# Altium project AmperMeter.PrjPcb
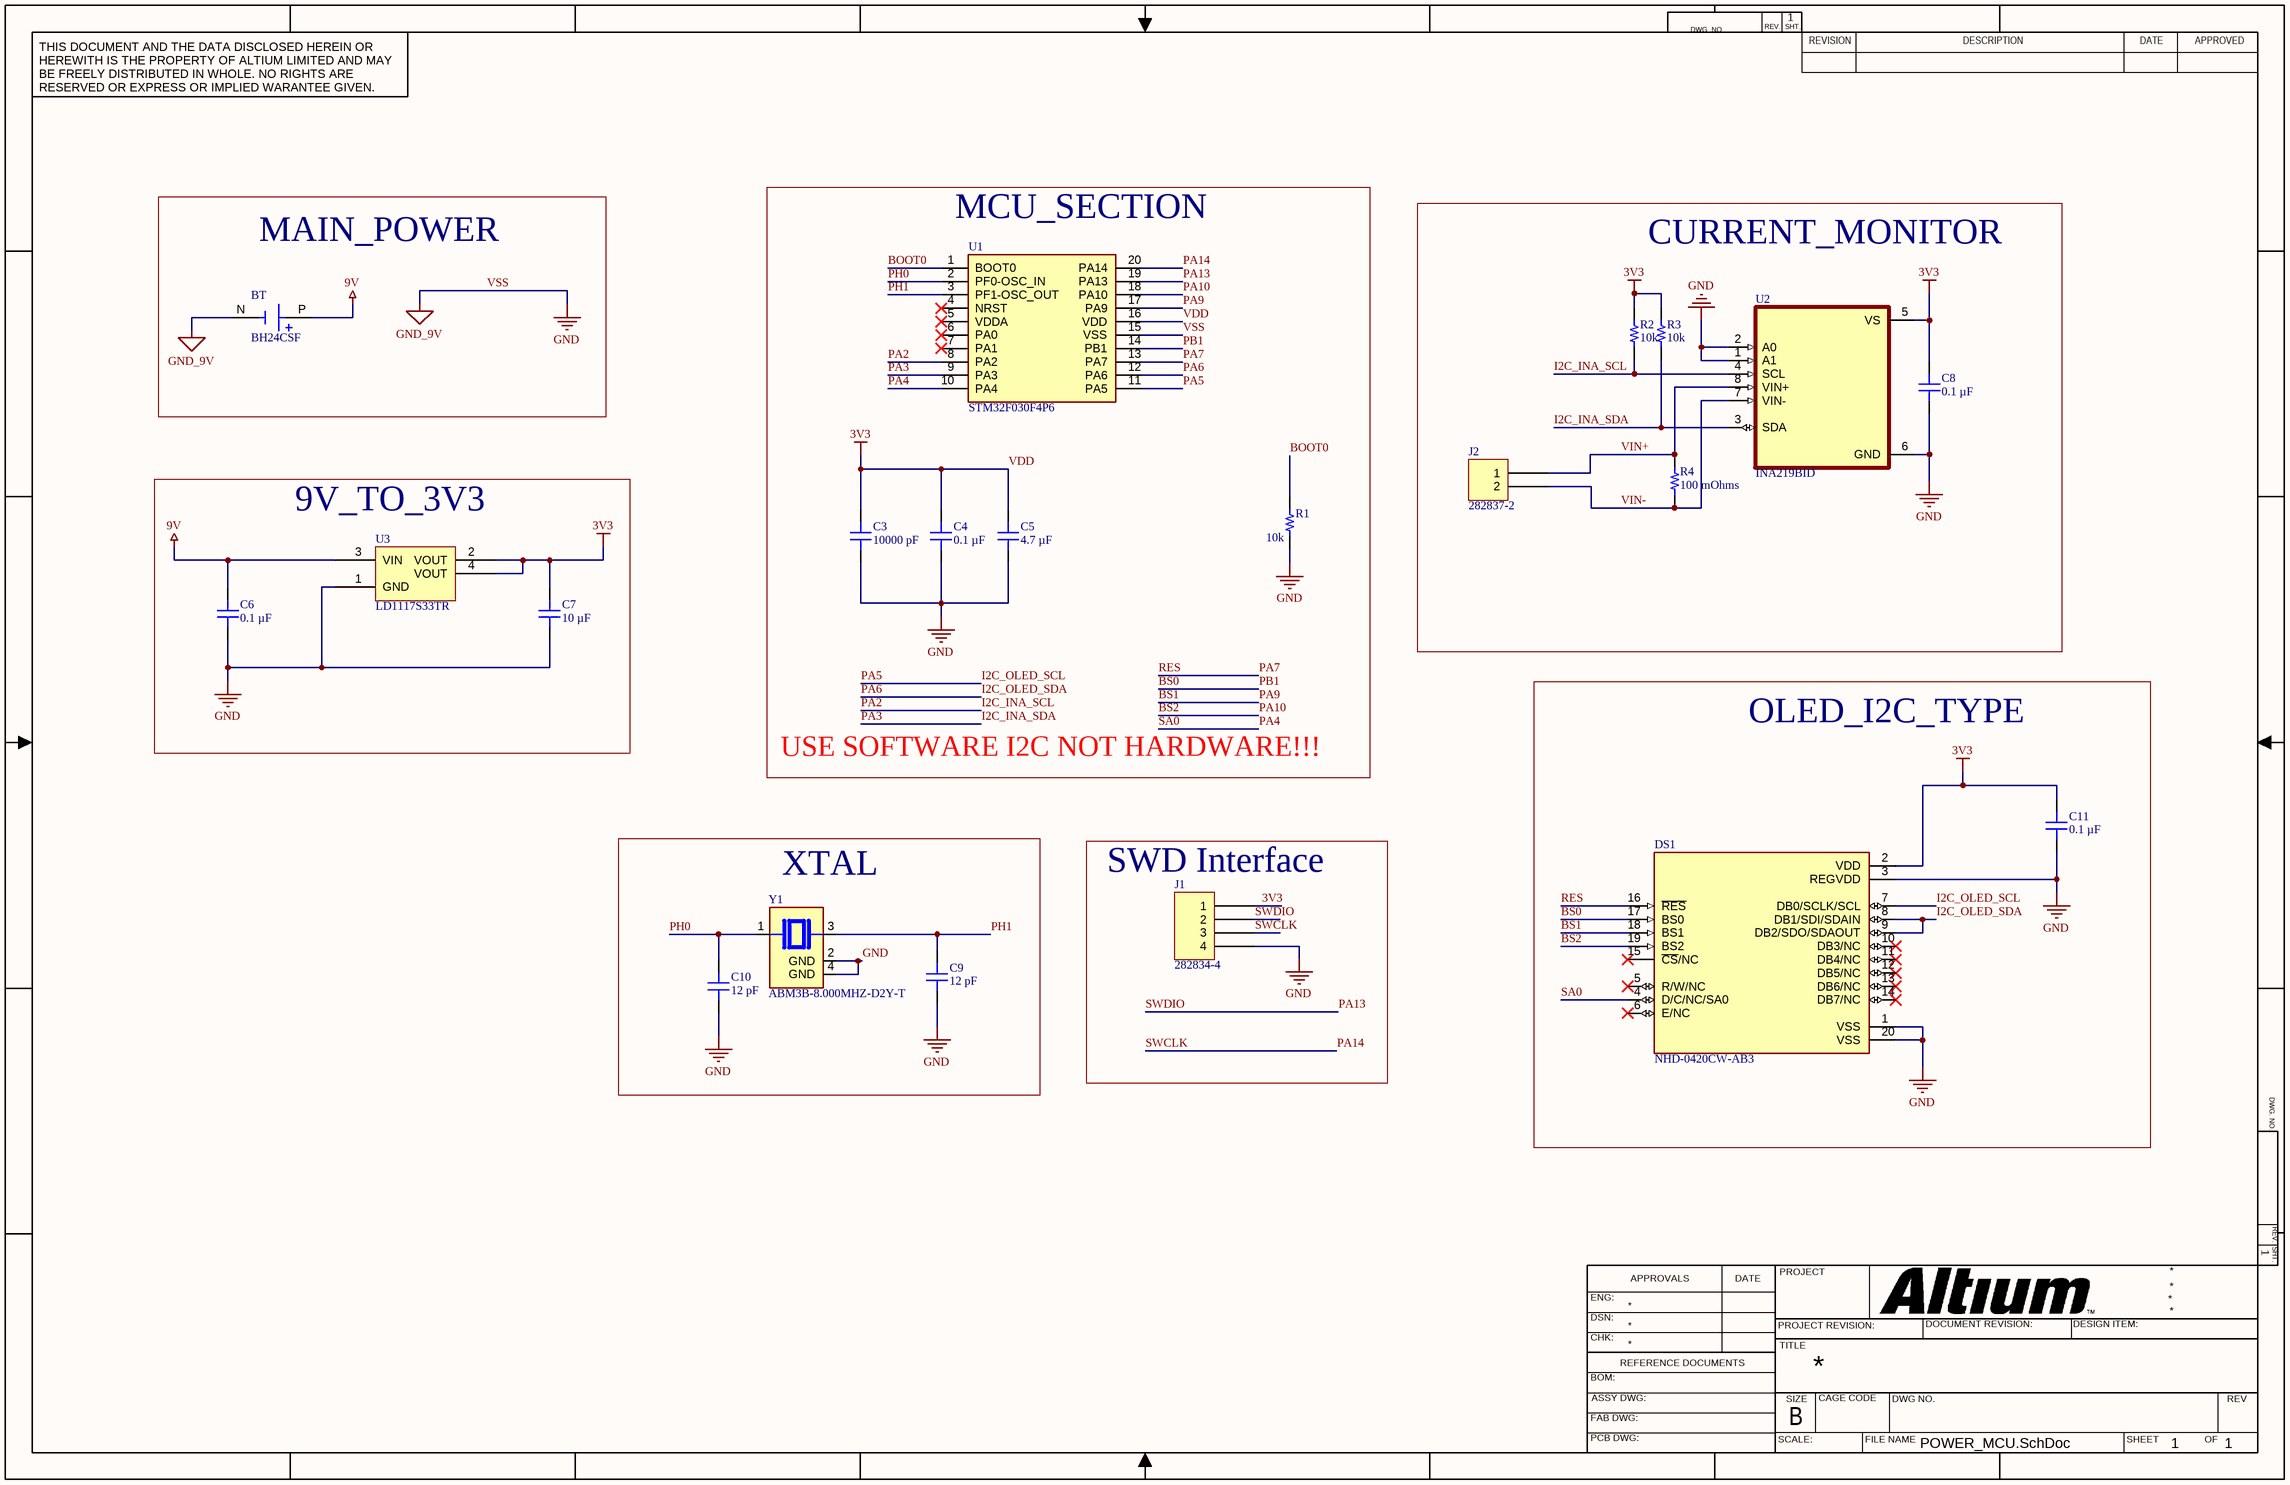
[diagram p0: POWER_MCU.SchDoc]
1 sheet, 21 parts. Net scope: global (net labels, ports and power ports of the same name join across sheets).
Board file: PCB2.PcbDoc

## Sheet POWER_MCU.SchDoc
size 431 x 279 mm; SheetNumber: 1; SheetTotal: 1

### Parts
BT  BH24CSF  [BAT_BH24CSF]
C3  10000 pF  [CAP 0805_2012]
C4  0.1 µF  [CAP 0805_2012]
C5  4.7 µF  [CAP 0805_2012]
C6  0.1 µF  [CAP 0805_2012]
C7  10 µF  [CAP 0805_2012]
C8  0.1 µF  [CAP 0805_2012]
C9  12 pF  [CAP 0402_1005]
C10  12 pF  [CAP 0402_1005]
C11  0.1 µF  [CAP 0805_2012]
DS1  NHD-0420CW-AB3  [LCD_NHD-0420CW-AB3]
J1  282834-4  [TE 282834-4]
J2  282837-2  [TE 282837-2]
R1  10k Ohms  [RES 0805_2012]  (value not drawn)
R2  10k  [RES 0805_2012]
R3  10k  [RES 0805_2012]
R4  100 mOhms  [RES 2512_6432]
U1  STM32F030F4P6  [TSSOP-20]
U2  INA219BID  [SOIC-8]
U3  LD1117S33TR  [ST SOT-223]
Y1  ABM3B-8.000MHZ-D2Y-T  [XTAL_ABM3B-8.000MHZ-D2Y-T]

### Blocks framed on the sheet
MAIN_POWER: BT
MCU_SECTION: C3-C5 R1 U1
CURRENT_MONITOR: C8 J2 R2-R4 U2
9V_TO_3V3: C6 C7 U3
OLED_I2C_TYPE: C11 DS1
XTAL: C9 C10 Y1
SWD Interface: J1

### Nets
3V3: C3.2 C4.2 C5.2 C7.2 C8.2 C11.2 DS1.2(VDD) J1.1 R2.2 R3.2 U1.16(VDD) U2.5(VS) U3.2(VOUT) U3.4(VOUT)  [also labelled VDD]
9V: BT.P(POS) C6.2 U3.3(VIN)
GND: BT.N(NEG) C3.1 C4.1 C5.1 C6.1 C7.1 C8.1 C9.1 C10.1 C11.1 DS1.1(VSS) DS1.3(REGVDD) DS1.20(VSS) J1.4 R1.1 U1.15(VSS) U2.1(A1) U2.2(A0) U2.6(GND) U3.1(GND) Y1.2(GND) Y1.4(GND)  [also labelled GND_9V, VSS]
BOOT0: R1.2 U1.1(BOOT0)
BS0: DS1.17(BS0) U1.14(PB1)  [also labelled PB1]
BS1: DS1.18(BS1) U1.17(PA9)  [also labelled PA9]
BS2: DS1.19(BS2) U1.18(PA10)  [also labelled PA10]
I2C_INA_SCL: R2.1 U1.8(PA2) U2.4(SCL)  [also labelled PA2]
I2C_INA_SDA: R3.1 U1.9(PA3) U2.3(SDA)  [also labelled PA3]
I2C_OLED_SCL: DS1.7(DB0/SCLK/SCL) U1.11(PA5)  [also labelled PA5]
I2C_OLED_SDA: DS1.8(DB1/SDI/SDAIN) DS1.9(DB2/SDO/SDAOUT) U1.12(PA6)  [also labelled PA6]
PA4: DS1.4(D/C/NC/SA0) U1.10(PA4)  [also labelled SA0]
PA7: DS1.16(~{RES}) U1.13(PA7)  [also labelled RES]
PA13: J1.2 U1.19(PA13)  [also labelled SWDIO]
PA14: J1.3 U1.20(PA14)  [also labelled SWCLK]
PH0: C10.2 U1.2(PF0-OSC_IN) Y1.1
PH1: C9.2 U1.3(PF1-OSC_OUT) Y1.3
VIN+: J2.1 R4.2 U2.8(VIN+)
VIN-: J2.2 R4.1 U2.7(VIN-)

Not connected (* = marked no-connect by the designer): DS1 5(R/W/NC)* 6(E/NC)* 10(DB3/NC)* 11(DB4/NC)* 12(DB5/NC)* 13(DB6/NC)* 14(DB7/NC)* 15(~{CS}/NC)*; U1 4(NRST)* 5(VDDA)* 6(PA0)* 7(PA1)*

### Notes on the sheet
- (near R1) 10k
- USE SOFTWARE I2C NOT HARDWARE!!!
- DWG. NO.
- REV.
- SHT.
- THIS DOCUMENT AND THE DATA DISCLOSED HEREIN OR HEREWITH IS THE PROPERTY OF ALTIUM LIMITED AND MAY BE FREELY DISTRIBUTED IN WHOLE. NO RIGHTS ARE RESERVED OR EXPRESS OR IMPLIED WARANTEE GIVEN.
- REVISION
- DESCRIPTION
- DATE
- APPROVED
- ENG:
- APPROVALS
- PROJECT
- DSN:
- CHK:
- REFERENCE DOCUMENTS
- PROJECT REVISION:
- TITLE
- DOCUMENT REVISION:
- DESIGN ITEM:
- BOM:
- FAB DWG:
- PCB DWG:
- ASSY DWG:
- SCALE:
- SIZE
- B
- CAGE CODE
- FILE NAME
- DWG NO.
- SHEET
- OF
- REV

### Library data of the parts
BT = BH24CSF: BATTERY HOLDER C 4 CELL 9V SNAP; MF: MPD; Price: None; SnapEDA_Link: https://www.snapeda.com/parts/BH24CSF/MPD/view-part/4389082/?ref=snap; MP: BH24CSF; Availability: Unavailable; Value: *; Package: None
C3 = C0805X103K1RAC3316: CAP CER 0805 10NF 100V X7R; manufacturer: KEMET; Tolerance: ±10%; Part Number: C0805X103K1RAC3316; Capacitance: 10000 pF; Applications: Automotive, Boardflex Sensitive; componentlink1description: Datasheet; componentlink1url: https://api.kemet.com/component-edge/download/datasheet/C0805X103K1RAC3316.pdf; componentlink2description: DigiKey Link; componentlink2url: https://www.digikey.com/en/products/detail/kemet/C0805X103K1RAC3316/10315780; Device Package: 0805 (2012 Metric); Features: Soft Termination; lastupdated: 9.02.2024 20:16:09; Lifecycle Status: Active; Minimum Order: 1; Mounting Type: Surface Mount, MLCC; Operating Temperature: -55°C ~ 125°C; Package / Case: 0805 (2012 Metric); packaging: TapeAndReel; partid: 2565; Part Status: Active; price: 0.02; Ratings: AEC-Q200; series: SMD Auto X7R VW80808; Size / Dimension: 0.079" L x 0.049" W (2.00mm x 1.25mm); Supplier 1: DigiKey; Supplier Part Number 1: 399-C0805X103K1RAC3316CT-ND; Temperature Coefficient: X7R; Thickness (Max): 0.039" (0.98mm); value: 10000 pF; Voltage - Rated: 100V
C4 C6 C8 C11 = C0805C104M5RACAUTO: CAP CER 0.1UF 50V X7R 0805; manufacturer: KEMET; Tolerance: ±20%; Part Number: C0805C104M5RACAUTO; Capacitance: 0.1 µF; Applications: Automotive, Bypass, Decoupling; componentlink1description: Datasheet; componentlink1url: https://api.kemet.com/component-edge/download/datasheet/C0805C104M5RACAUTO.pdf; componentlink2description: DigiKey Link; componentlink2url: https://www.digikey.com/en/products/detail/kemet/C0805C104M5RACAUTO/5762233; Device Package: 0805 (2012 Metric); lastupdated: 9.02.2024 20:16:09; Lifecycle Status: Active; Minimum Order: 1; Mounting Type: Surface Mount, MLCC; Operating Temperature: -55°C ~ 125°C; Package / Case: 0805 (2012 Metric); packaging: TapeAndReel; partid: 2568; Part Status: Active; price: 0.01; Ratings: AEC-Q200; series: SMD Auto X7R; Size / Dimension: 0.079" L x 0.049" W (2.00mm x 1.25mm); Supplier 1: DigiKey; Supplier Part Number 1: 399-12977-1-ND; Temperature Coefficient: X7R; Thickness (Max): 0.035" (0.88mm); value: 0.1 µF; Voltage - Rated: 50V
C5 = C0805X475J9RACAUTO: CAP CER 4.7UF 6.3V X7R 0805; manufacturer: KEMET; Tolerance: ±5%; Part Number: C0805X475J9RACAUTO; Capacitance: 4.7 µF; Applications: Automotive, Boardflex Sensitive; componentlink1description: Datasheet; componentlink1url: https://api.kemet.com/component-edge/download/datasheet/C0805X475J9RACAUTO.pdf; componentlink2description: DigiKey Link; componentlink2url: https://www.digikey.com/en/products/detail/kemet/C0805X475J9RACAUTO/7427557; Device Package: 0805 (2012 Metric); Features: Soft Termination; lastupdated: 9.02.2024 20:16:08; Lifecycle Status: Active; Minimum Order: 1; Mounting Type: Surface Mount, MLCC; Operating Temperature: -55°C ~ 125°C; Package / Case: 0805 (2012 Metric); packaging: TapeAndReel; partid: 2889; Part Status: Active; price: 0.20; Ratings: AEC-Q200; series: SMD Auto X7R Flex; Size / Dimension: 0.079" L x 0.049" W (2.00mm x 1.25mm); Supplier 1: DigiKey; Supplier Part Number 1: 399-15727-1-ND; Temperature Coefficient: X7R; Thickness (Max): 0.057" (1.45mm); value: 4.7 µF; Voltage - Rated: 6.3V
C7 = CL21Y106KPQVPNE: CAP CER 10UF 10V X7S 0805; manufacturer: Samsung Electro-Mechanics; Tolerance: ±10%; Part Number: CL21Y106KPQVPNE; Capacitance: 10 µF; Applications: Automotive; componentlink1description: Datasheet; componentlink1url: http://www.samsungsem.com/kr/support/product-search/mlcc/CL21Y106KPQVPNE.jsp; componentlink2description: DigiKey Link; componentlink2url: https://www.digikey.com/en/products/detail/samsung-electro-mechanics/CL21Y106KPQVPNE/5961169; Device Package: 0805 (2012 Metric); lastupdated: 9.02.2024 20:16:08; Lifecycle Status: Active; Minimum Order: 1; Mounting Type: Surface Mount, MLCC; Operating Temperature: -55°C ~ 125°C; Package / Case: 0805 (2012 Metric); packaging: TapeAndReel; partid: 2979; Part Status: Active; price: 0.06; Ratings: AEC-Q200; series: CL; Size / Dimension: 0.079" L x 0.049" W (2.00mm x 1.25mm); Supplier 1: DigiKey; Supplier Part Number 1: 1276-6685-1-ND; Temperature Coefficient: X7S; Thickness (Max): 0.055" (1.40mm); value: 10 µF; Voltage - Rated: 10V
C9 C10 = CBR04C120F5GAC: CAP CER 12PF 50V C0G/NP0 0402; manufacturer: KEMET; Temperature Coefficient: C0G, NP0; Tolerance: ±1%; Part Number: CBR04C120F5GAC; Capacitance: 12 pF; Applications: RF, Microwave, High Frequency; componentlink1description: Datasheet; componentlink1url: https://api.kemet.com/component-edge/download/datasheet/CBR04C120F5GAC.pdf; componentlink2description: DigiKey Link; componentlink2url: https://www.digikey.com/en/products/detail/kemet/CBR04C120F5GAC/3479654; Device Package: 0402 (1005 Metric); Features: High Q, Low Loss, Ultra Low ESR; lastupdated: 9.02.2024 20:04:38; Lifecycle Status: Active; Minimum Order: 1; Mounting Type: Surface Mount, MLCC; Operating Temperature: -55°C ~ 125°C; Package / Case: 0402 (1005 Metric); packaging: TapeAndReel; partid: 1750; Part Status: Active; price: 0.06; series: CBR-SMD RF C0G; Size / Dimension: 0.039" L x 0.020" W (1.00mm x 0.50mm); Supplier 1: DigiKey; Supplier Part Number 1: 399-8815-1-ND; Thickness (Max): 0.022" (0.55mm); value: 12 pF; Voltage - Rated: 50V
DS1 = NHD-0420CW-AB3: Character OLED;4x20;920x31.5;Char OLED Module;Blue;4/8-bit Parallel, SPI, I2C | Newhaven Display International NHD-0420CW-AB3; SnapEDA_Link: https://www.snapeda.com/parts/NHD-0420CW-AB3/Newhaven+Display+Intl/view-part/?ref=snap; Package: None; Value: *; MF: Newhaven Display; MP: NHD-0420CW-AB3; Check_prices: https://www.snapeda.com/parts/NHD-0420CW-AB3/Newhaven+Display+Intl/view-part/?ref=eda
J1 = 282834-4: TERM BLK 4P SIDE ENT 2.54MM PCB; Manufacturer: TE Connectivity AMP Connectors; Current: 10A; Mating Orientation: Horizontal with Board; Number of Levels: 1; Pitch: 0.100" (2.54mm); Positions Per Level: 4; Voltage: 150V; Wire Gauge: 16-30 AWG; Wire Termination: Screw - Rising Cage Clamp; Part Number: 282834-4; Color: Green; ComponentLink1Description: Datasheet; ComponentLink1URL: https://www.te.com/commerce/DocumentDelivery/DDEController?Action=srchrtrv&DocNm=282834&DocType=Customer+Drawing&DocLang=English; ComponentLink2Description: DigiKey Link; ComponentLink2URL: http://digikey.com/product-detail/en/te-connectivity-amp-connectors/282834-4/A98335-ND/1153265; LastUpdated: 15.01.2020 04:16:05; Lifecycle Status: Active; Minimum Order: 1; Mounting Type: Through Hole; Packaging: Bulk; Part Status: Active; Price: 2.68; Series: Buchanan; Supplier 1: DigiKey; Supplier Part Number 1: A98335-ND
J2 = 282837-2: TERM BLK 2P SIDE ENT 5.08MM PCB; Manufacturer: TE Connectivity AMP Connectors; Current: 13.5 A; Mating Orientation: Horizontal with Board; Number of Levels: 1; Pitch: 0.200" (5.08mm); Positions Per Level: 2; Voltage: 300 V; Wire Gauge: 16-28 AWG; Wire Termination: Screw - Rising Cage Clamp; Part Number: 282837-2; Color: Green; ComponentLink1Description: Datasheet; ComponentLink1URL: https://www.te.com/commerce/DocumentDelivery/DDEController?Action=srchrtrv&DocNm=282837&DocType=Customer+Drawing&DocLang=English; ComponentLink2Description: DigiKey Link; ComponentLink2URL: https://www.digikey.com/en/products/detail/te-connectivity-amp-connectors/282837-2/2187973; Features: Interlocking (Side); LastUpdated: 21.06.2022 15:00:23; Lifecycle Status: Active; Minimum Order: 1; Mounting Type: Through Hole; Packaging: Tray; Part Status: Active; Price: 0.31; Series: Buchanan; Supplier 1: DigiKey; Supplier Part Number 1: A113320-ND
R1 = TLRZ2ATTD: RES 0 OHM JUMPER 0805; Manufacturer: KOA Speer Electronics, Inc.; Value: 0 Ohms; Part Number: TLRZ2ATTD; ComponentLink1Description: Datasheet; ComponentLink1URL: http://www.koaspeer.com/catimages/Products/TLRZ/TLRZ.pdf; ComponentLink2Description: DigiKey Link; ComponentLink2URL: https://www.digikey.com/en/products/detail/koa-speer-electronics-inc/TLRZ2ATTD/9845494; Composition: Metal Element; Device Package: 0805 (2012 Metric); Features: Automotive AEC-Q200, Current Sense; Height - Seated (Max): 0.022" (0.55mm); LastUpdated: 8.02.2024 21:02:39; Lifecycle Status: Active; Minimum Order: 1; Number of Terminations: 2; Operating Temperature: -55°C ~ 170°C; Package / Case: 0805 (2012 Metric); Packaging: TapeAndReel; PartId: 27685; Part Status: Active; Price: 0.08; Ratings: AEC-Q200; Resistance: 0 Ohms; Series: TLRZ; Size / Dimension: 0.079" L x 0.049" W (2.00mm x 1.25mm); Supplier 1: DigiKey; Supplier Part Number 1: 2019-TLRZ2ATTDCT-ND; Supplier Device Package: 0805; Tolerance: Jumper
R2 R3 = RNCS0805BKE10K0: RES 10K OHM 0.1% 1/10W 0805; Manufacturer: Stackpole Electronics Inc; Power (Watts): 0.1W, 1/10W; Resistance: 10 kOhms; Temperature Coefficient: ±25ppm/°C; Part Number: RNCS0805BKE10K0; Value: 10k; ComponentLink1Description: Datasheet; ComponentLink1URL: https://www.seielect.com/catalog/sei-rncs_rnch.pdf; ComponentLink2Description: DigiKey Link; ComponentLink2URL: https://www.digikey.com/en/products/detail/stackpole-electronics-inc/RNCS0805BKE10K0/1800067; Composition: Thin Film; Device Package: 0805 (2012 Metric); Features: Anti-Corrosive, Automotive AEC-Q200, Moisture Resistant; Height - Seated (Max): 0.026" (0.65mm); LastUpdated: 8.02.2024 21:02:39; Lifecycle Status: Active; Minimum Order: 1; Number of Terminations: 2; Operating Temperature: -55°C ~ 155°C; Package / Case: 0805 (2012 Metric); Packaging: TapeAndReel; PartId: 27713; Part Status: Active; Price: 0.07; Ratings: AEC-Q200; Series: RNCS; Size / Dimension: 0.079" L x 0.049" W (2.00mm x 1.25mm); Supplier 1: DigiKey; Supplier Part Number 1: RNCS0805BKE10K0CT-ND; Supplier Device Package: 0805; Tolerance: ±0.1%
R4 = CSRF2512FTR100: RES 0.1 OHM 1% 2W 2512; manufacturer: Stackpole Electronics Inc; Temperature Coefficient: ±50ppm/°C; Part Number: CSRF2512FTR100; componentlink1description: Datasheet; componentlink1url: https://www.seielect.com/catalog/sei-csrf.pdf; componentlink2description: DigiKey Link; componentlink2url: http://digikey.com/product-detail/en/stackpole-electronics-inc/CSRF2512FTR100/CSRF2512FTR100CT-ND/6594080; Composition: Metal Foil; Device Package: 2512 (6432 Metric); Features: Automotive AEC-Q200, Current Sense, Moisture Resistant; Height - Seated (Max): 0.037" (0.95mm); lastupdated: 11.04.2023 20:12:35; Lifecycle Status: Active; Minimum Order: 1; Number of Terminations: 2; Operating Temperature: -55°C ~ 170°C; Package / Case: 2512 (6432 Metric); packaging: TapeAndReel; Part Status: Active; Power (Watts): 2W; price: 0.30; Ratings: AEC-Q200; Resistance: 100 mOhms; series: CSRF; Size / Dimension: 0.254" L x 0.128" W (6.45mm x 3.25mm); Supplier 1: DigiKey; Supplier Part Number 1: CSRF2512FTR100CT-ND; Supplier Device Package: 2512; Tolerance: ±1%; value: 100 mOhms
U1 = STM32F030F4P6: 32-Bit MCU Cortex-M0 16KB Flash TSSOP20 STM32F030F4P6, 32 bit ARM Cortex M0 Microcontroller 48MHz 16 kB Flash, 4 kB RAM, I2C 20-Pin TSSOP; Manufacturer_Name: STMicroelectronics; Geometry.Height: 1.2mm; Mouser Part Number: 511-STM32F030F4P6; Mouser Price/Stock: https://www.mouser.co.uk/ProductDetail/STMicroelectronics/STM32F030F4P6?qs=eyrSuY1LhL02tVhJ92aI6g%3D%3D; Manufacturer_Part_Number: STM32F030F4P6; Datasheet Link: http://www.st.com/web/en/resource/technical/document/datasheet/DM00088500.pdf
U2 = INA219BID: 26V, 12-bit, i2c output current/voltage/power monitor; MF: Texas Instruments; Value: *; SnapEDA_Link: https://www.snapeda.com/parts/INA219BID/Texas+Instruments/view-part/?ref=snap; Purchase-URL: https://pricing.snapeda.com/search/part/INA219BID/?ref=eda; Availability: In Stock; Price: None; Package: SOIC-8 Texas Instruments; Check_prices: https://www.snapeda.com/parts/INA219BID/Texas+Instruments/view-part/?ref=eda; MP: INA219BID
U3 = LD1117S33TR: IC REG LINEAR 3.3V 800MA SOT223; Manufacturer: STMicroelectronics; Current - Quiescent (Iq): 10 mA; Number of Regulators: 1; Output Configuration: Positive; Output Type: Fixed; Protection Features: Over Current, Over Temperature; PSRR: 75dB (120Hz); Voltage Dropout (Max): 1.2V @ 800mA; Voltage - Input (Max): 15V; Part Number: LD1117S33TR; ComponentLink1Description: Datasheet; ComponentLink1URL: http://www.st.com/content/ccc/resource/technical/document/datasheet/99/3b/7d/91/91/51/4b/be/CD00000544.pdf/files/CD00000544.pdf/jcr:content/translations/en.CD00000544.pdf; ComponentLink2Description: DigiKey Link; ComponentLink2URL: https://www.digikey.com/en/products/detail/stmicroelectronics/LD1117S33TR/585766; Current - Output: 800mA; LastUpdated: 3.06.2024 20:14:20; Lifecycle Status: Active; Minimum Order: 1; Mounting Type: Surface Mount; Operating Temperature: 0°C ~ 125°C; Package / Case: TO-261-4, TO-261AA; Packaging: TapeAndReel; Part Status: Active; Price: 0.13; Series: -; Supplier 1: DigiKey; Supplier Part Number 1: 497-1242-1-ND; Supplier Device Package: SOT-223; Voltage - Output (Min/Fixed): 3.3V
Y1 = ABM3B-8.000MHZ-D2Y-T: Crystal 8MHz Â±20ppm (Tol) Â±30ppm (Stability) 18pF FUND 200Ohm 4-Pin CSMD T/R; MF: Abracon LLC; Value: *; Availability: In Stock; SnapEDA_Link: https://www.snapeda.com/parts/ABM3B-8.000MHZ-D2Y-T/Abracon+LLC/view-part/?ref=snap; Check_prices: https://www.snapeda.com/parts/ABM3B-8.000MHZ-D2Y-T/Abracon+LLC/view-part/?ref=eda; Package: Package; Purchase-URL: https://pricing.snapeda.com/search/part/ABM3B-8.000MHZ-D2Y-T/?ref=eda; MP: ABM3B-8.000MHZ-D2Y-T; Price: None